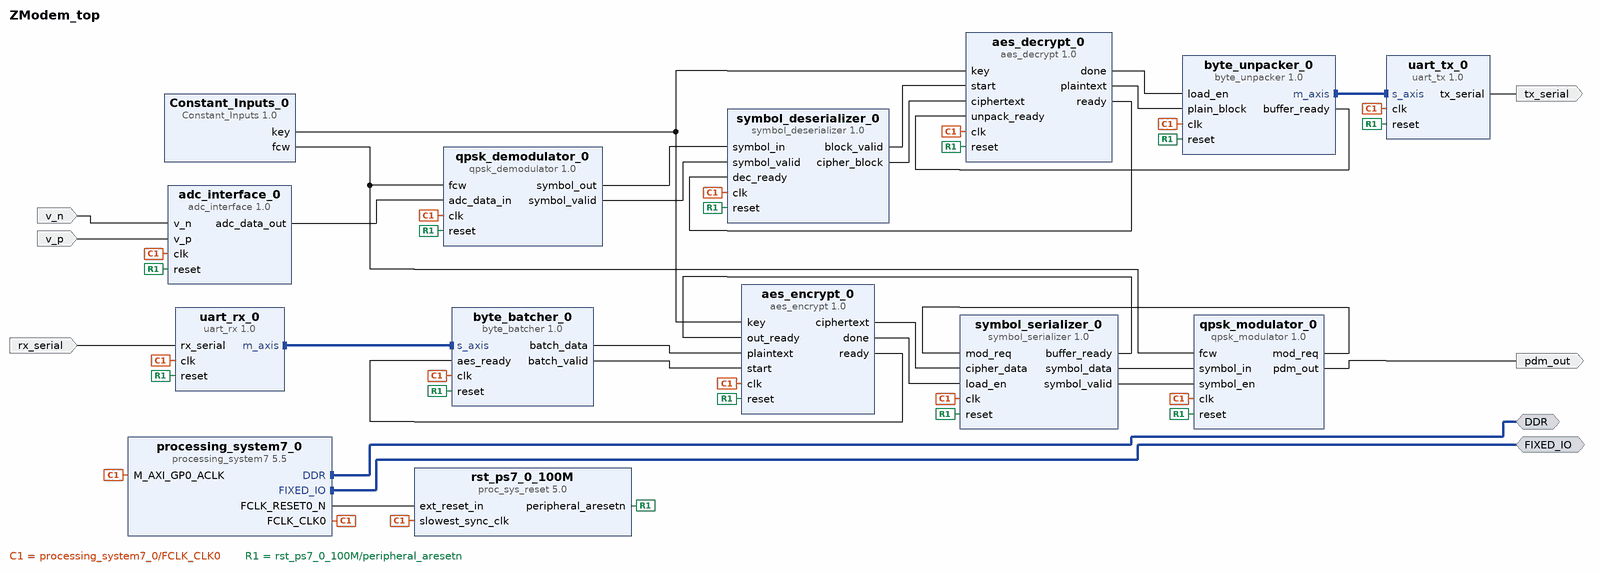
[diagram p0: block diagram of the top level]
# Vivado block design ZModem_top, xc7z020clg400-1, Vivado 2025.1
create_bd_design ZModem_top

create_bd_intf_port -mode Master -vlnv xilinx.com:interface:ddrx_rtl:1.0 DDR
create_bd_intf_port -mode Master -vlnv xilinx.com:display_processing_system7:fixedio_rtl:1.0 FIXED_IO
create_bd_port -dir I v_n
create_bd_port -dir I v_p
create_bd_port -dir I rx_serial
create_bd_port -dir O tx_serial
create_bd_port -dir O pdm_out

create_bd_cell -type ip -vlnv xilinx.com:user:uart_rx:1.0 uart_rx_0
create_bd_cell -type ip -vlnv xilinx.com:user:uart_tx:1.0 uart_tx_0
create_bd_cell -type ip -vlnv xilinx.com:user:adc_interface:1.0 adc_interface_0
create_bd_cell -type ip -vlnv xilinx.com:user:aes_decrypt:1.0 aes_decrypt_0
create_bd_cell -type ip -vlnv xilinx.com:user:aes_encrypt:1.0 aes_encrypt_0
create_bd_cell -type ip -vlnv xilinx.com:user:byte_batcher:1.0 byte_batcher_0
create_bd_cell -type ip -vlnv xilinx.com:user:byte_unpacker:1.0 byte_unpacker_0
create_bd_cell -type ip -vlnv xilinx.com:user:symbol_serializer:1.0 symbol_serializer_0
create_bd_cell -type ip -vlnv xilinx.com:user:symbol_deserializer:1.0 symbol_deserializer_0
create_bd_cell -type ip -vlnv xilinx.com:user:qpsk_modulator:1.0 qpsk_modulator_0
create_bd_cell -type ip -vlnv xilinx.com:user:qpsk_demodulator:1.0 qpsk_demodulator_0
create_bd_cell -type ip -vlnv xilinx.com:ip:processing_system7:5.5 processing_system7_0
set_property -dict [list \
  CONFIG.PCW_APU_PERIPHERAL_FREQMHZ 667 \
  CONFIG.PCW_ENET0_ENET0_IO {MIO 16 .. 27} \
  CONFIG.PCW_ENET0_GRP_MDIO_ENABLE 1 \
  CONFIG.PCW_ENET0_GRP_MDIO_IO {MIO 52 .. 53} \
  CONFIG.PCW_ENET0_PERIPHERAL_ENABLE 1 \
  CONFIG.PCW_ENET0_RESET_ENABLE 0 \
  CONFIG.PCW_ENET_RESET_ENABLE 1 \
  CONFIG.PCW_ENET_RESET_SELECT {Share reset pin} \
  CONFIG.PCW_FPGA0_PERIPHERAL_FREQMHZ 100 \
  CONFIG.PCW_GPIO_MIO_GPIO_ENABLE 1 \
  CONFIG.PCW_GPIO_MIO_GPIO_IO MIO \
  CONFIG.PCW_I2C_RESET_ENABLE 0 \
  CONFIG.PCW_PRESET_BANK1_VOLTAGE {LVCMOS 1.8V} \
  CONFIG.PCW_QSPI_GRP_FBCLK_ENABLE 1 \
  CONFIG.PCW_QSPI_GRP_FBCLK_IO {MIO 8} \
  CONFIG.PCW_QSPI_GRP_SINGLE_SS_ENABLE 1 \
  CONFIG.PCW_QSPI_GRP_SINGLE_SS_IO {MIO 1 .. 6} \
  CONFIG.PCW_QSPI_PERIPHERAL_ENABLE 1 \
  CONFIG.PCW_QSPI_QSPI_IO {MIO 1 .. 6} \
  CONFIG.PCW_SD0_GRP_CD_ENABLE 1 \
  CONFIG.PCW_SD0_GRP_CD_IO {MIO 47} \
  CONFIG.PCW_SD0_GRP_WP_ENABLE 0 \
  CONFIG.PCW_SD0_PERIPHERAL_ENABLE 1 \
  CONFIG.PCW_SD0_SD0_IO {MIO 40 .. 45} \
  CONFIG.PCW_SDIO_PERIPHERAL_FREQMHZ 50 \
  CONFIG.PCW_SINGLE_QSPI_DATA_MODE x4 \
  CONFIG.PCW_UART1_PERIPHERAL_ENABLE 1 \
  CONFIG.PCW_UART1_UART1_IO {MIO 48 .. 49} \
  CONFIG.PCW_UART_PERIPHERAL_FREQMHZ 100 \
  CONFIG.PCW_UIPARAM_DDR_FREQ_MHZ 533.333333 \
  CONFIG.PCW_UIPARAM_DDR_MEMORY_TYPE {DDR 3 (Low Voltage)} \
  CONFIG.PCW_UIPARAM_DDR_PARTNO {MT41K256M16 RE-125} \
  CONFIG.PCW_USB0_PERIPHERAL_ENABLE 1 \
  CONFIG.PCW_USB0_RESET_ENABLE 1 \
  CONFIG.PCW_USB0_RESET_IO {MIO 46} \
  CONFIG.PCW_USB0_USB0_IO {MIO 28 .. 39} \
  CONFIG.PCW_USB_RESET_ENABLE 1 \
  CONFIG.PCW_USB_RESET_SELECT {Share reset pin} \
] [get_bd_cells processing_system7_0]
# 298 more settings of processing_system7_0 are not shown: defaults, MIO pin electricals, DDR timing, and values the tool derives
create_bd_cell -type ip -vlnv xilinx.com:ip:proc_sys_reset:5.0 rst_ps7_0_100M
create_bd_cell -type ip -vlnv xilinx.com:user:Constant_Inputs:1.0 Constant_Inputs_0

# ---- connections ----

connect_bd_intf_net [get_bd_intf_pins byte_unpacker_0/m_axis] [get_bd_intf_pins uart_tx_0/s_axis]
connect_bd_intf_net [get_bd_intf_ports DDR] [get_bd_intf_pins processing_system7_0/DDR]
connect_bd_intf_net [get_bd_intf_ports FIXED_IO] [get_bd_intf_pins processing_system7_0/FIXED_IO]
connect_bd_intf_net [get_bd_intf_pins uart_rx_0/m_axis] [get_bd_intf_pins byte_batcher_0/s_axis]
connect_bd_net [get_bd_pins Constant_Inputs_0/fcw] [get_bd_pins qpsk_modulator_0/fcw] [get_bd_pins qpsk_demodulator_0/fcw]
connect_bd_net [get_bd_pins Constant_Inputs_0/key] [get_bd_pins aes_decrypt_0/key] [get_bd_pins aes_encrypt_0/key]
connect_bd_net [get_bd_pins adc_interface_0/adc_data_out] [get_bd_pins qpsk_demodulator_0/adc_data_in]
connect_bd_net [get_bd_pins aes_decrypt_0/done] [get_bd_pins byte_unpacker_0/load_en]
connect_bd_net [get_bd_pins aes_decrypt_0/plaintext] [get_bd_pins byte_unpacker_0/plain_block]
connect_bd_net [get_bd_pins aes_decrypt_0/ready] [get_bd_pins symbol_deserializer_0/dec_ready]
connect_bd_net [get_bd_pins aes_encrypt_0/ciphertext] [get_bd_pins symbol_serializer_0/cipher_data]
connect_bd_net [get_bd_pins aes_encrypt_0/done] [get_bd_pins symbol_serializer_0/load_en]
connect_bd_net [get_bd_pins aes_encrypt_0/ready] [get_bd_pins byte_batcher_0/aes_ready]
connect_bd_net [get_bd_pins byte_batcher_0/batch_data] [get_bd_pins aes_encrypt_0/plaintext]
connect_bd_net [get_bd_pins byte_batcher_0/batch_valid] [get_bd_pins aes_encrypt_0/start]
connect_bd_net [get_bd_pins byte_unpacker_0/buffer_ready] [get_bd_pins aes_decrypt_0/unpack_ready]
connect_bd_net [get_bd_pins processing_system7_0/FCLK_CLK0] \
  [get_bd_pins aes_decrypt_0/clk] [get_bd_pins rst_ps7_0_100M/slowest_sync_clk] [get_bd_pins aes_encrypt_0/clk] \
  [get_bd_pins byte_batcher_0/clk] [get_bd_pins uart_rx_0/clk] [get_bd_pins byte_unpacker_0/clk] [get_bd_pins uart_tx_0/clk] \
  [get_bd_pins qpsk_modulator_0/clk] [get_bd_pins symbol_deserializer_0/clk] [get_bd_pins symbol_serializer_0/clk] \
  [get_bd_pins processing_system7_0/M_AXI_GP0_ACLK] [get_bd_pins adc_interface_0/clk] [get_bd_pins qpsk_demodulator_0/clk]
connect_bd_net [get_bd_pins processing_system7_0/FCLK_RESET0_N] [get_bd_pins rst_ps7_0_100M/ext_reset_in]
connect_bd_net [get_bd_pins qpsk_demodulator_0/symbol_out] [get_bd_pins symbol_deserializer_0/symbol_in]
connect_bd_net [get_bd_pins qpsk_demodulator_0/symbol_valid] [get_bd_pins symbol_deserializer_0/symbol_valid]
connect_bd_net [get_bd_pins qpsk_modulator_0/mod_req] [get_bd_pins symbol_serializer_0/mod_req]
connect_bd_net [get_bd_pins qpsk_modulator_0/pdm_out] [get_bd_ports pdm_out]
connect_bd_net [get_bd_pins rst_ps7_0_100M/peripheral_aresetn] \
  [get_bd_pins aes_decrypt_0/reset] [get_bd_pins aes_encrypt_0/reset] [get_bd_pins byte_batcher_0/reset] \
  [get_bd_pins uart_rx_0/reset] [get_bd_pins byte_unpacker_0/reset] [get_bd_pins uart_tx_0/reset] \
  [get_bd_pins qpsk_modulator_0/reset] [get_bd_pins symbol_deserializer_0/reset] [get_bd_pins symbol_serializer_0/reset] \
  [get_bd_pins adc_interface_0/reset] [get_bd_pins qpsk_demodulator_0/reset]
connect_bd_net -net rx_serial_0_1 [get_bd_ports rx_serial] [get_bd_pins uart_rx_0/rx_serial]
connect_bd_net [get_bd_pins symbol_deserializer_0/block_valid] [get_bd_pins aes_decrypt_0/start]
connect_bd_net [get_bd_pins symbol_deserializer_0/cipher_block] [get_bd_pins aes_decrypt_0/ciphertext]
connect_bd_net [get_bd_pins symbol_serializer_0/buffer_ready] [get_bd_pins aes_encrypt_0/out_ready]
connect_bd_net [get_bd_pins symbol_serializer_0/symbol_data] [get_bd_pins qpsk_modulator_0/symbol_in]
connect_bd_net [get_bd_pins symbol_serializer_0/symbol_valid] [get_bd_pins qpsk_modulator_0/symbol_en]
connect_bd_net [get_bd_pins uart_tx_0/tx_serial] [get_bd_ports tx_serial]
connect_bd_net -net v_n_0_1 [get_bd_ports v_n] [get_bd_pins adc_interface_0/v_n]
connect_bd_net -net v_p_0_1 [get_bd_ports v_p] [get_bd_pins adc_interface_0/v_p]

validate_bd_design
save_bd_design
